# EAGLE design xv11_controller (EAGLE 8.1.0)
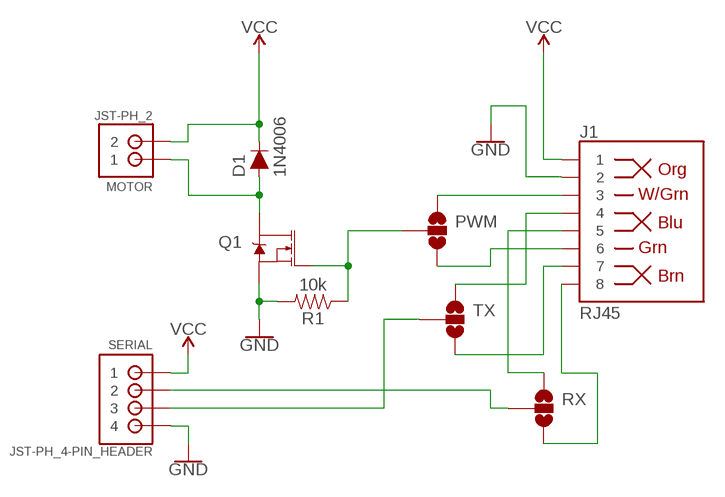
[diagram p0: schematic, sheet 1]

## Parts
D1  1N4006  DIODE-PTH  [DIODE-1N4001]
J1  RJ45  RJ45-8  [RJ45-8]
MOTOR  JST-PH_2  JST-PH_2-PIN_HEADER  [JST_B2B-PH_HEADER]
PWM  JUMPER-SMT_3_NO_NO-SILK  [SMT-JUMPER_3_NO_NO-SILK]
Q1  MOSFET-NCH-FQP30N06L  [TO220V]
R1  10k  1KOHM-HORIZ-1/4W-1%  [AXIAL-0.3]
RX  JUMPER-SMT_3_NO_NO-SILK  [SMT-JUMPER_3_NO_NO-SILK]
SERIAL  JST-PH_4-PIN_HEADER  [JST_B4B-PH_HEADER]
TX  JUMPER-SMT_3_NO_NO-SILK  [SMT-JUMPER_3_NO_NO-SILK]

## Nets
GND: J1.2 Q1.3(S) R1.P$2 SERIAL.P4
N$1: PWM.2 Q1.1(G) R1.P$1
N$2: D1.A MOTOR.P1 Q1.2(D)
N$4: J1.3 PWM.1
N$7: J1.6 PWM.3
N$8: J1.4 TX.1
N$9: J1.7 TX.3
N$10: J1.5 RX.1
N$11: J1.8 RX.3
RX: RX.2 SERIAL.P2
TX: SERIAL.P3 TX.2
VCC: D1.C J1.1 MOTOR.P2 SERIAL.P1

## Library data of the parts
D1 = SparkFun-DiscreteSemi:DIODE: Diode These are standard reverse protection diodes and small signal diodes. SparkFun Products: SparkFun SparkPunk Sound Kit <https://www.sparkfun.com/products/11177> SparkFun ESP8266 Thing <https://www.sparkfun.com/products/13231>; PROD_ID: DIO-09176; VALUE: 1A/50V/1.1V
J1 = SparkFun-Connectors:RJ45-8: RJ45 Jack - 8 pin Simple RJ45, 8-pin connection. Commonly used for Cat5, Cat5e, and Cat6 Ethernet cables. Here is the connector we sell at SparkFun: RJ45 8-Pin Connector <https://www.sparkfun.com/products/643> (PRT-00643) Datasheet <https://cdn.sparkfun.com/datasheets/Prototyping/04908.pdf> It is used on this SparkFun product: SparkFun RJ45 Breakout <https://www.sparkfun.com/products/716> (BOB-00716) Note, you may also be interested in the "MAGJACK" version of this. It is basically a RJ45 connector, but also has some status LEDs built into the connector housing. You can check that out in this library at the device named "MAGJACK.dev" and see these products online: RJ45 Ethernet MagJack-Compatible <https://www.sparkfun.com/products/8534> (PRT-08534) SparkFun RJ45 MagJack Breakout <https://www.sparkfun.com/products/13021> (BOB-13021); PROD_ID: CONN-08506; SF_ID: PRT-00643
MOTOR = SRG:JST-PH_2-PIN_HEADER: 2-pin JST PH Shrouded Header, top entry P/N B2B-PH-K-S Mating connector PHR-2 Mating cable assembly: Sparkfun PRT-09914 <http://www.sparkfun.com/products/9914>
PWM RX TX = SparkFun-Jumpers:JUMPER-SMT_3_NO: Normally open jumper This jumper has three pads in close proximity to each other. Apply solder to close the connection(s).
Q1 = SparkFun-DiscreteSemi:MOSFET-NCH: N-channel MOSFETs Voltage controlled devices that allow control of high current outputs. SparkFun Products: SparkFun OpenScale <https://www.sparkfun.com/products/13261> SparkFun Digital Sandbox <https://www.sparkfun.com/products/12651> SparkFun Monster Moto Shield <https://www.sparkfun.com/products/10182> SparkFun MOSFET Power Controller <https://www.sparkfun.com/products/11214>; PROD_ID: TRANS-10060; VALUE: 60V/32A/35mΩ
R1 = SparkFun-Resistors:1KOHM: 1kΩ resistor A resistor is a passive two-terminal electrical component that implements electrical resistance as a circuit element. Resistors act to reduce current flow, and, at the same time, act to lower voltage levels within circuits. - Wikipedia; PROD_ID: RES-12182; VALUE: 1k
SERIAL = SRG:JST-PH_4-PIN_HEADER: 4-pin JST PH Shrouded Header, top entry P/N B4B-PH-K-S Mating connector PHR-4 Mating cable assembly: Sparkfun PRT-09916 <http://www.sparkfun.com/products/9916>

## Board
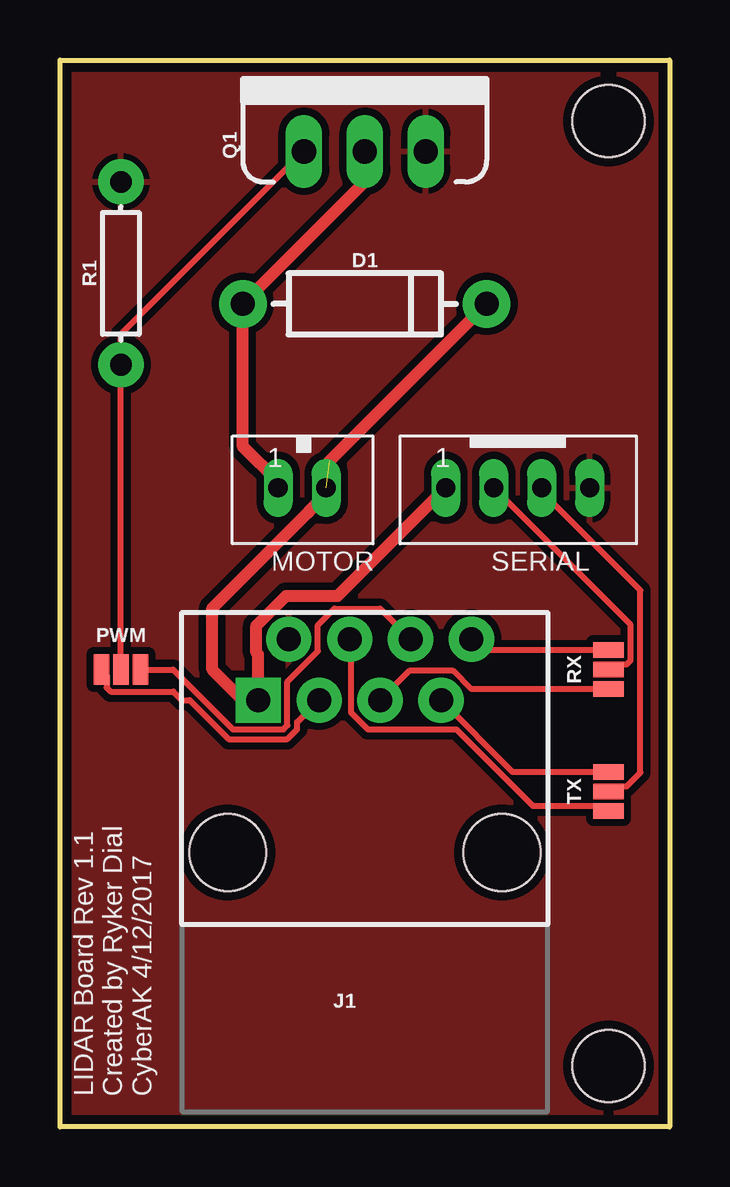
[diagram p1: board, top side]
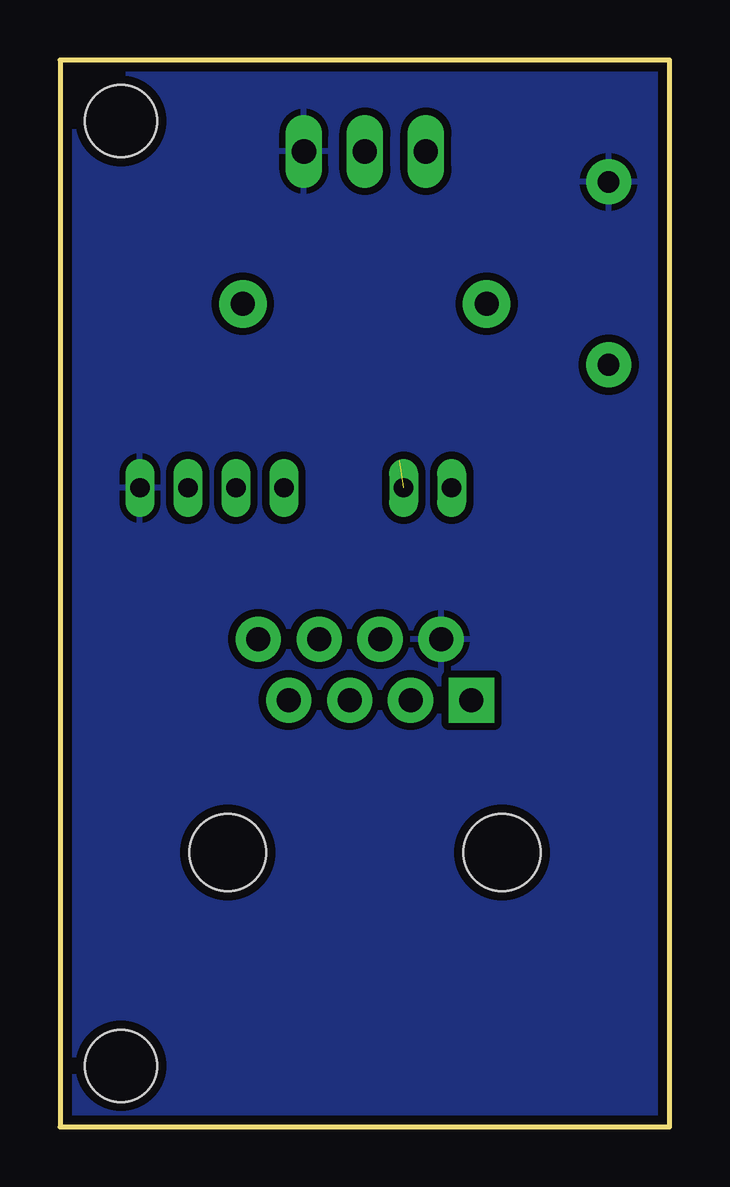
[diagram p2: board, bottom side, seen from below]

Size 25.4 x 44.45 mm. Coordinates in mm from the lower left corner, seen from the top.
Outline: 0,0 0,44.45 25.4,44.45 25.4,0 0,0
Copper layers (1*16): Top 0.0356mm / dielectric 1.5011mm / Bottom 0.0356mm
Design rules "LaenPCBOrder": minimum track width 6mil, minimum drill 13mil, track to track 6mil, track to pad 6mil, pad to pad 6mil, via to via 6mil, smd to smd 6mil, copper to edge 15mil, drill to drill 6mil, minimum pad ring 7mil, minimum via ring 7mil, stop-mask expansion 3mil, vias tented up to drill 0mil, thermal gap 10mil
Holes 3 mm at 22.86,41.91 22.86,2.54

### Footprints (pad centres in the part's own frame; a part is rotated, then mirrored left to right if it is on the bottom)
DIODE-1N4001 = drill 1 pad 1.981: A -5.08,0; C 5.08,0
RJ45-8 = drill 1 pad 1.88 square: 1 -4.445,6.35 | drill 1 pad 1.88: 2 -3.175,8.89; 3 -1.905,6.35; 4 -0.635,8.89; 5 0.635,6.35; 6 1.905,8.89; 7 3.175,6.35; 8 4.445,8.89 | hole 3.2: -5.715,0; 5.715,0
JST_B2B-PH_HEADER = drill 0.8 long: P1 1.075,0.048; P2 -0.925,0.048
SMT-JUMPER_3_NO_NO-SILK = smd 0.635 x 1.27: 1 -0.813,0; 2 0,0; 3 0.813,0
TO220V = drill 1.016 long: 1 -2.54,0; 2 0,0; 3 2.54,0
AXIAL-0.3 = drill 0.9 pad 1.88: P$1 -3.81,0; P$2 3.81,0
JST_B4B-PH_HEADER = drill 0.8 long: P1 2.98,0.048; P2 0.98,0.048; P3 -1.02,0.048; P4 -3.02,0.048

### Placement (x,y rotation side)
D1  12.7,34.29 0 top
J1  12.7,11.43 0 top
MOTOR  10.16,26.67 180 top
PWM  2.54,19.05 0 top
Q1  12.7,40.64 0 top
R1  2.54,35.56 90 top
RX  22.86,19.05 90 top
SERIAL  19.05,26.67 180 top
TX  22.86,13.97 90 top

### Tracks (layer width: path | path; a pad name or v marks a point on that pad's centre or on a via)
GND
  pour Bottom (isolate 0.305): 0,0 0,44.45 25.4,44.45 25.4,0
  pour Top (isolate 0.305): 0,0 0,44.45 25.4,44.45 25.4,0
N$1
  Top 0.254: PWM.2 R1.P$1 2.54,33.02 Q1.1
N$2
  Top 0.508: Q1.2 12.7,39.37 D1.A 7.62,28.33 9.09,26.87 MOTOR.P1
N$4
  Top 0.254: PWM.1 1.94,18.83 1.94,18.3 2.11,18.14 4.72,18.14 5.08,17.78 5.41,17.78 7.03,16.15 9.48,16.15 9.88,16.56 9.88,16.87 J1.3
N$7
  Top 0.254: PWM.3 4.71,19.05 7.2,16.56 9.31,16.56 9.47,16.72 9.47,18.55 10.74,19.82 10.74,20.9 11.43,21.59 13.34,21.59 J1.6
N$8
  Top 0.254: J1.4 12.12,20.27 12.12,17.27 12.83,16.56 16.52,16.56 19.71,13.37 22.64,13.37 TX.1
N$9
  Top 0.254: TX.3 18.87,14.78 J1.7
N$10
  Top 0.254: RX.1 17.14,18.24 16.38,19 14.55,19 J1.5
N$11
  Top 0.254: RX.3 17.6,19.86 J1.8
RX
  Top 0.254: RX.2 23.08,19.27 23.61,19.27 23.77,19.43 23.77,20.92 SERIAL.P2
TX
  Top 0.254: TX.2 23.08,14.19 23.61,14.19 24.18,14.76 24.18,22.36 20.07,26.47 SERIAL.P3
VCC  (1 unrouted)
  Top 0.508: 15.97,26.72 SERIAL.P1 11.57,22.12 9.43,22.12 8.18,20.88 8.18,19.76 8.26,19.69 J1.1 7.62,17.78 6.35,19.05 6.35,21.61 10.15,25.41 10.35,25.6 11.09,26.34 MOTOR.P2 | 11.23,27.75 D1.C

### Text on the board
tPlace: LIDAR Board Rev 1.1 / Created by Ryker Dial / CyberAK 4/12/2017